# Altium schematic sheet RAM.SchDoc
size B; SheetNumber: 4; SheetTotal: 5
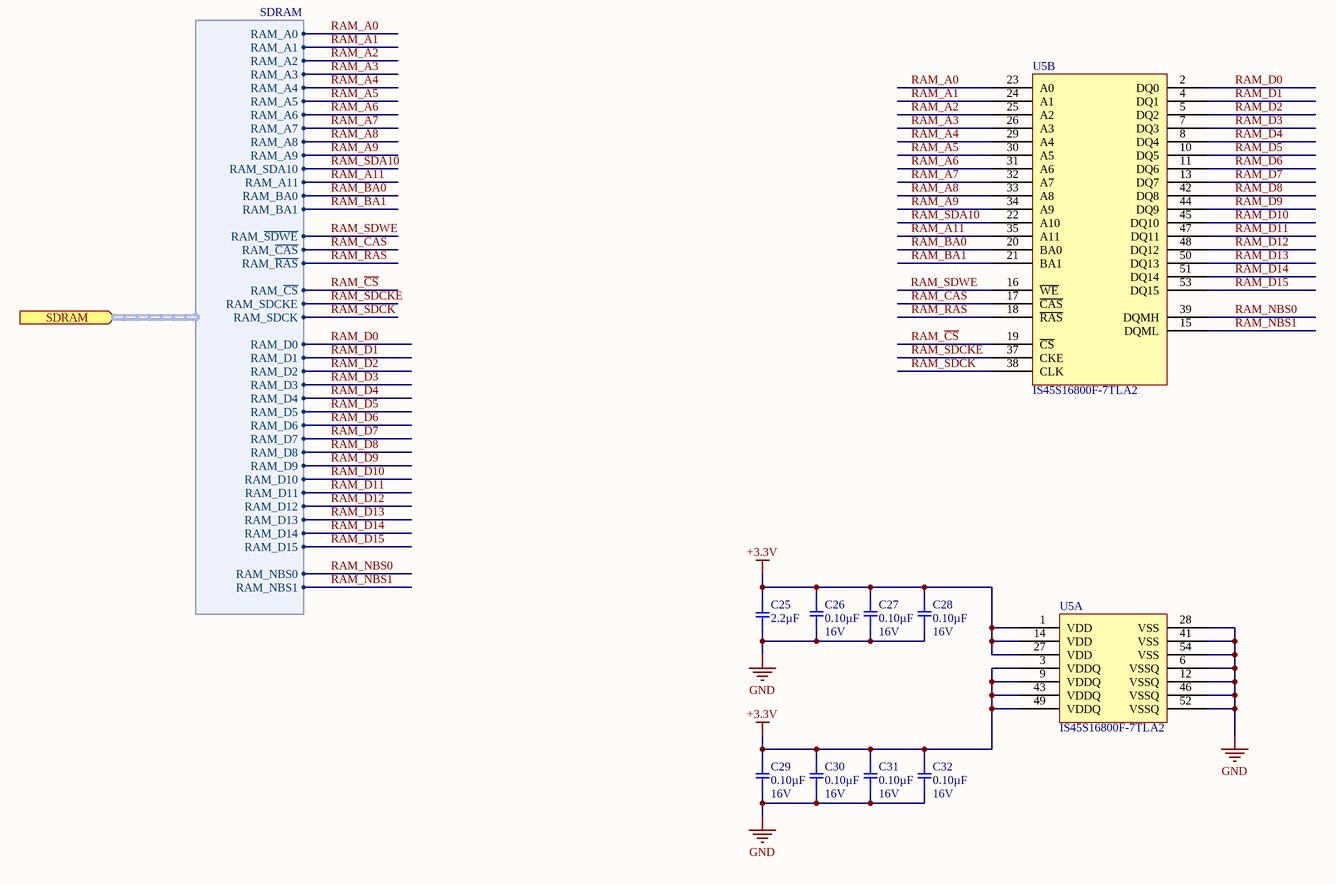
[diagram p0: RAM.SchDoc]

## Parts
C25  2.2µF  [SMD-0603C]
C26  0.10µF  Voltage: 16V  [SMD-0402C]
C27  0.10µF  Voltage: 16V  [SMD-0402C]
C28  0.10µF  Voltage: 16V  [SMD-0402C]
C29  0.10µF  Voltage: 16V  [SMD-0402C]
C30  0.10µF  Voltage: 16V  [SMD-0402C]
C31  0.10µF  Voltage: 16V  [SMD-0402C]
C32  0.10µF  Voltage: 16V  [SMD-0402C]
U5  IS45S16800F-7TLA2  [TSOP80P1180X120-54N]  (parts A,B of 2)

## Ports
SDRAM (in, harness SDRAM)

## Harnesses
SDRAM: RAM_A0, RAM_A1, RAM_A2, RAM_A3, RAM_A4, RAM_A5, RAM_A6, RAM_A7, RAM_A8, RAM_A9, RAM_SDA10, RAM_A11, RAM_BA0, RAM_BA1, RAM_~{SDWE}, RAM_~{CAS}, RAM_~{RAS}, RAM_SDCKE, RAM_SDCK, RAM_~{CS}, RAM_D0, RAM_D1, RAM_D2, RAM_D3, RAM_D4, RAM_D5, RAM_D6, RAM_D7, RAM_D8, RAM_D9, RAM_D10, RAM_D11, RAM_D12, RAM_D13, RAM_D14, RAM_D15, RAM_NBS0, RAM_NBS1

## Nets
+3.3V: C25.1 C26.2 C27.2 C28.2 C29.2 C30.2 C31.2 C32.2 U5.1(VDD) U5.3(VDDQ) U5.9(VDDQ) U5.14(VDD) U5.27(VDD) U5.43(VDDQ) U5.49(VDDQ)
GND: C25.2 C26.1 C27.1 C28.1 C29.1 C30.1 C31.1 C32.1 U5.6(VSSQ) U5.12(VSSQ) U5.28(VSS) U5.41(VSS) U5.46(VSSQ) U5.52(VSSQ) U5.54(VSS)
RAM_A0: U5.23(A0) ; port SDRAM.RAM_A0
RAM_A1: U5.24(A1) ; port SDRAM.RAM_A1
RAM_A2: U5.25(A2) ; port SDRAM.RAM_A2
RAM_A3: U5.26(A3) ; port SDRAM.RAM_A3
RAM_A4: U5.29(A4) ; port SDRAM.RAM_A4
RAM_A5: U5.30(A5) ; port SDRAM.RAM_A5
RAM_A6: U5.31(A6) ; port SDRAM.RAM_A6
RAM_A7: U5.32(A7) ; port SDRAM.RAM_A7
RAM_A8: U5.33(A8) ; port SDRAM.RAM_A8
RAM_A9: U5.34(A9) ; port SDRAM.RAM_A9
RAM_A11: U5.35(A11) ; port SDRAM.RAM_A11
RAM_BA0: U5.20(BA0) ; port SDRAM.RAM_BA0
RAM_BA1: U5.21(BA1) ; port SDRAM.RAM_BA1
RAM_~{CS}: U5.19(~{CS}) ; port SDRAM.RAM_~{CS}
RAM_CAS: U5.17(~{CAS}) ; port SDRAM.RAM_~{CAS}
RAM_D0: U5.2(DQ0) ; port SDRAM.RAM_D0
RAM_D1: U5.4(DQ1) ; port SDRAM.RAM_D1
RAM_D2: U5.5(DQ2) ; port SDRAM.RAM_D2
RAM_D3: U5.7(DQ3) ; port SDRAM.RAM_D3
RAM_D4: U5.8(DQ4) ; port SDRAM.RAM_D4
RAM_D5: U5.10(DQ5) ; port SDRAM.RAM_D5
RAM_D6: U5.11(DQ6) ; port SDRAM.RAM_D6
RAM_D7: U5.13(DQ7) ; port SDRAM.RAM_D7
RAM_D8: U5.42(DQ8) ; port SDRAM.RAM_D8
RAM_D9: U5.44(DQ9) ; port SDRAM.RAM_D9
RAM_D10: U5.45(DQ10) ; port SDRAM.RAM_D10
RAM_D11: U5.47(DQ11) ; port SDRAM.RAM_D11
RAM_D12: U5.48(DQ12) ; port SDRAM.RAM_D12
RAM_D13: U5.50(DQ13) ; port SDRAM.RAM_D13
RAM_D14: U5.51(DQ14) ; port SDRAM.RAM_D14
RAM_D15: U5.53(DQ15) ; port SDRAM.RAM_D15
RAM_NBS0: U5.39(DQMH) ; port SDRAM.RAM_NBS0
RAM_NBS1: U5.15(DQML) ; port SDRAM.RAM_NBS1
RAM_RAS: U5.18(~{RAS}) ; port SDRAM.RAM_~{RAS}
RAM_SDA10: U5.22(A10) ; port SDRAM.RAM_SDA10
RAM_SDCK: U5.38(CLK) ; port SDRAM.RAM_SDCK
RAM_SDCKE: U5.37(CKE) ; port SDRAM.RAM_SDCKE
RAM_SDWE: U5.16(~{WE}) ; port SDRAM.RAM_~{SDWE}

## Notes on the sheet
- Let's Build Rocket's Inc. Modular Paylaod System Based on TMP-010 Rev
  For more information visit https://github.com/LetsBuildRockets/Modular-Payload-System
  This work is licensed under CC BY-NC 4.0. To view a copy of this license, visit https://creativecommons.org/licenses/by-nc/4.0
- Title
- Size:
- Date:
- Assembly Variant:
- B
- Number:
- Time:
- Revision:
- Sheet
- of
- Author:
- File:

## Library data of the parts
C25 = GCM188R70J225KE22D: CAP CER 2.2UF 6.3V X7R 0603; Manufacturer: Murata Electronics North America; Factory Stock: 0; Unit Price (USD): 0.23; Minimum Quantity: 1; Tolerance: ±10%; Datasheets: http://www.murata.com/~/media/webrenewal/support/library/catalog/products/capacitor/mlcc/c03e.ashx; Image: //media.digikey.com/Renders/Murata%20Renders/0603%28GCM188%29.jpg; Digi-Key Part Number: 490-5316-1-ND; Part Number: GCM188R70J225KE22D; Quantity Available: 20695; @ qty: 0; Packaging: Cut Tape (CT); Series: GCM; Part Status: Active; Value: 2.2µF; Voltage: 6.3V; Temperature Coefficient: X7R; Operating Temperature: -55°C ~ 125°C; Features: -; Ratings: AEC-Q200; Applications: Automotive; Mounting Type: Surface Mount, MLCC; Package / Case: 0603 (1608 Metric); Size / Dimension: 0.063" L x 0.031" W (1.60mm x 0.80mm); Height - Seated (Max): -; Thickness (Max): 0.035" (0.90mm); Lead Spacing: -; Lead Style: -
C26-C32 = GCM155R71C104KA55D: CAP CER 0.1UF 16V X7R 0402; Manufacturer: Murata Electronics North America; Factory Stock: 0; Unit Price (USD): 0.1; Minimum Quantity: 1; Tolerance: ±10%; Datasheets: http://www.murata.com/~/media/webrenewal/support/library/catalog/products/capacitor/mlcc/c03e.ashx; Image: //media.digikey.com/Renders/Murata%20Renders/ZRB-SERIES-0402.jpg; Digi-Key Part Number: 490-4759-1-ND; Part Number: GCM155R71C104KA55D; Quantity Available: 734194; @ qty: 0; Packaging: Cut Tape (CT); Series: GCM; Part Status: Active; Value: 0.10µF; Temperature Coefficient: X7R; Operating Temperature: -55°C ~ 125°C; Features: -; Ratings: AEC-Q200; Applications: Automotive; Mounting Type: Surface Mount, MLCC; Package / Case: 0402 (1005 Metric); Size / Dimension: 0.039" L x 0.020" W (1.00mm x 0.50mm); Height - Seated (Max): -; Thickness (Max): 0.022" (0.55mm); Lead Spacing: -; Lead Style: -
U5 = IS45S16800F-7TLA2: Unit Price (USD): 5.18